# Altium schematic sheet version_control_for_pcb_routing.SchDoc
size A4
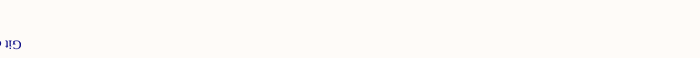
[diagram p0: version_control_for_pcb_routing.SchDoc]

## Notes on the sheet
- Git doesen't see the pcb-boards changes so this is a hack to get version control on the routing